# Altium schematic sheet Debounce Filter.SchDoc
size A4; Organization: TESLA Motors, INC; Address1: 3500 Deer Creek Road; Address2: Palo Alto, CA; Address4: U.S.A.; SheetNumber: 20; SheetTotal: 21
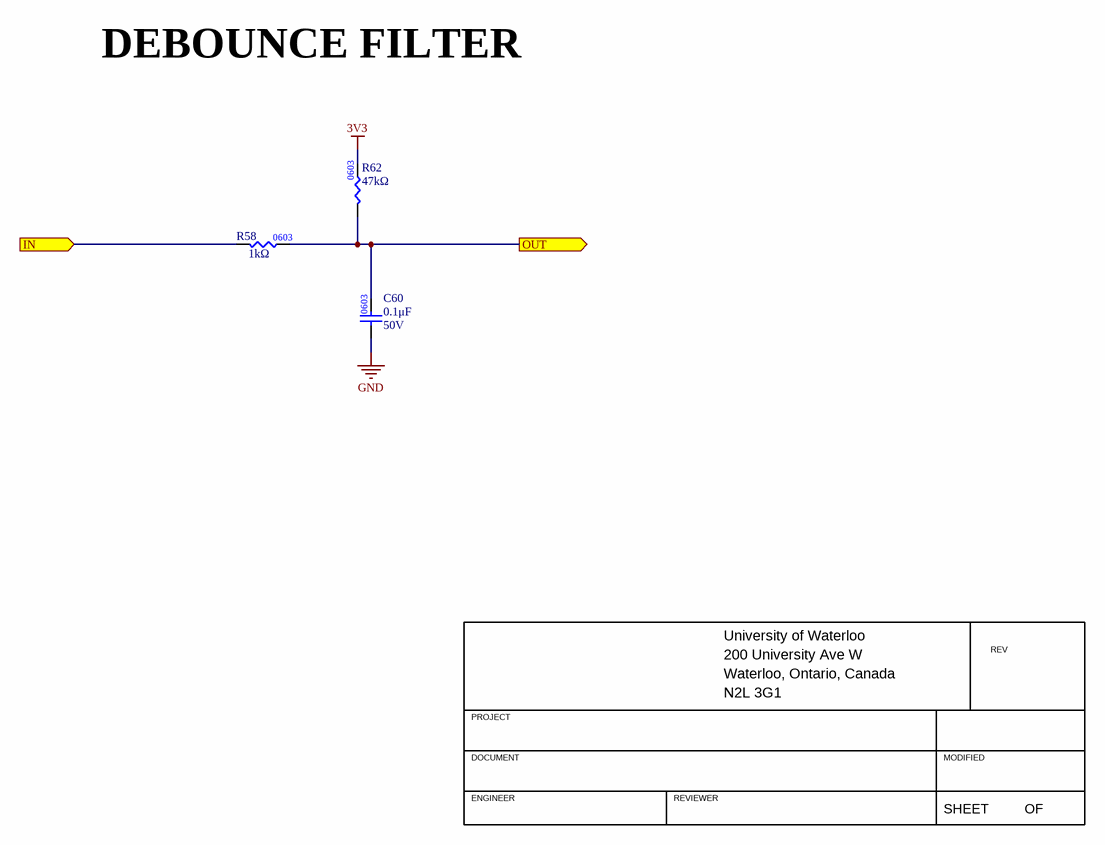
[diagram p0: Debounce Filter.SchDoc]

## Parts
C60  value 0.1μF  Voltage Rating: 50V  [CAP0603]  (hidden comment: CAP_0.1uF_50V_0603)
R58  value 1kΩ  [RES0603]  (hidden comment: RES_1kΩ_0603_1%)
R62  value 47kΩ  [RES0603]  (hidden comment: RES_47kΩ_0603_1%)

## Ports
IN (in), OUT (out)

## Nets
3V3: R62.2
GND: C60.1
IN: R58.1 ; port IN
OUT: C60.2 R58.2 R62.1 ; port OUT

## Notes on the sheet
- DEBOUNCE FILTER
- University of Waterloo
- 200 University Ave W
- REV
- PROJECT
- Waterloo, Ontario, Canada
- N2L 3G1
- DOCUMENT
- ENGINEER
- REVIEWER
- MODIFIED
- SHEET
- OF

## Library data of the parts
C60 = CAP_0.1uF_50V_0603: CAP CER 0.1UF 50V X7R 0603; Manufacturer 1: Yageo; Manufacturer Part Number 1: CC0603KRX7R9BB104; Package/Footprint: 0603; Supplier 1: Digi-Key; Supplier Part Number 1: 311-1344-1-ND; Mounting Type: SMD; Dielectric: X7R
R58 = RES_1kΩ_0603_1%: RES 1K OHM 1% 1/8W 0603; Manufacturer 1: Stackpole Electronics Inc; Manufacturer Part Number 1: RNCP0603FTD1K00; Supplier Part Number 1: RNCP0603FTD1K00CT-ND; Supplier 1: Digi-Key; Mounting Type: SMD; Package: 0603
R62 = RES_47kΩ_0603_1%: RES 47K OHM 1% 1/10W 0603; Manufacturer 1: YAGEO; Manufacturer Part Number 1: RC0603FR-0747KL; Supplier Part Number 1: 311-4.70KHRCT-ND; Supplier 1: DigiKey; Mounting Type: SMD; Package: 0603